# Altium schematic sheet RA8D2 MCU - Ports.SchDoc
size A3; Company Name: Renesas Electronics America; CompanyURL: www.renesas.com; PageSetup: Record=PageOptions|CenterHorizontal=True|CenterVertical=True|PrintScale=1.00|XCorrection=1.00|YCorrection=1.00|PrintKind=1|BorderSize=5000000|LeftOffset=0|BottomOffset=0|Orientation=2|PaperLength=1000|PaperWidth=1000|Scale=100|PaperSource=7|PrintQuality=-4|MediaType=1|DitherType=10|PaperKind=A5 148x210mm|PrintScaleMode=1; ReleaseDate: 16.09.2025; Version: MP; SheetNumber: 9; SheetTotal: 18; VariantNumber: 0; DSheetNumber: 1
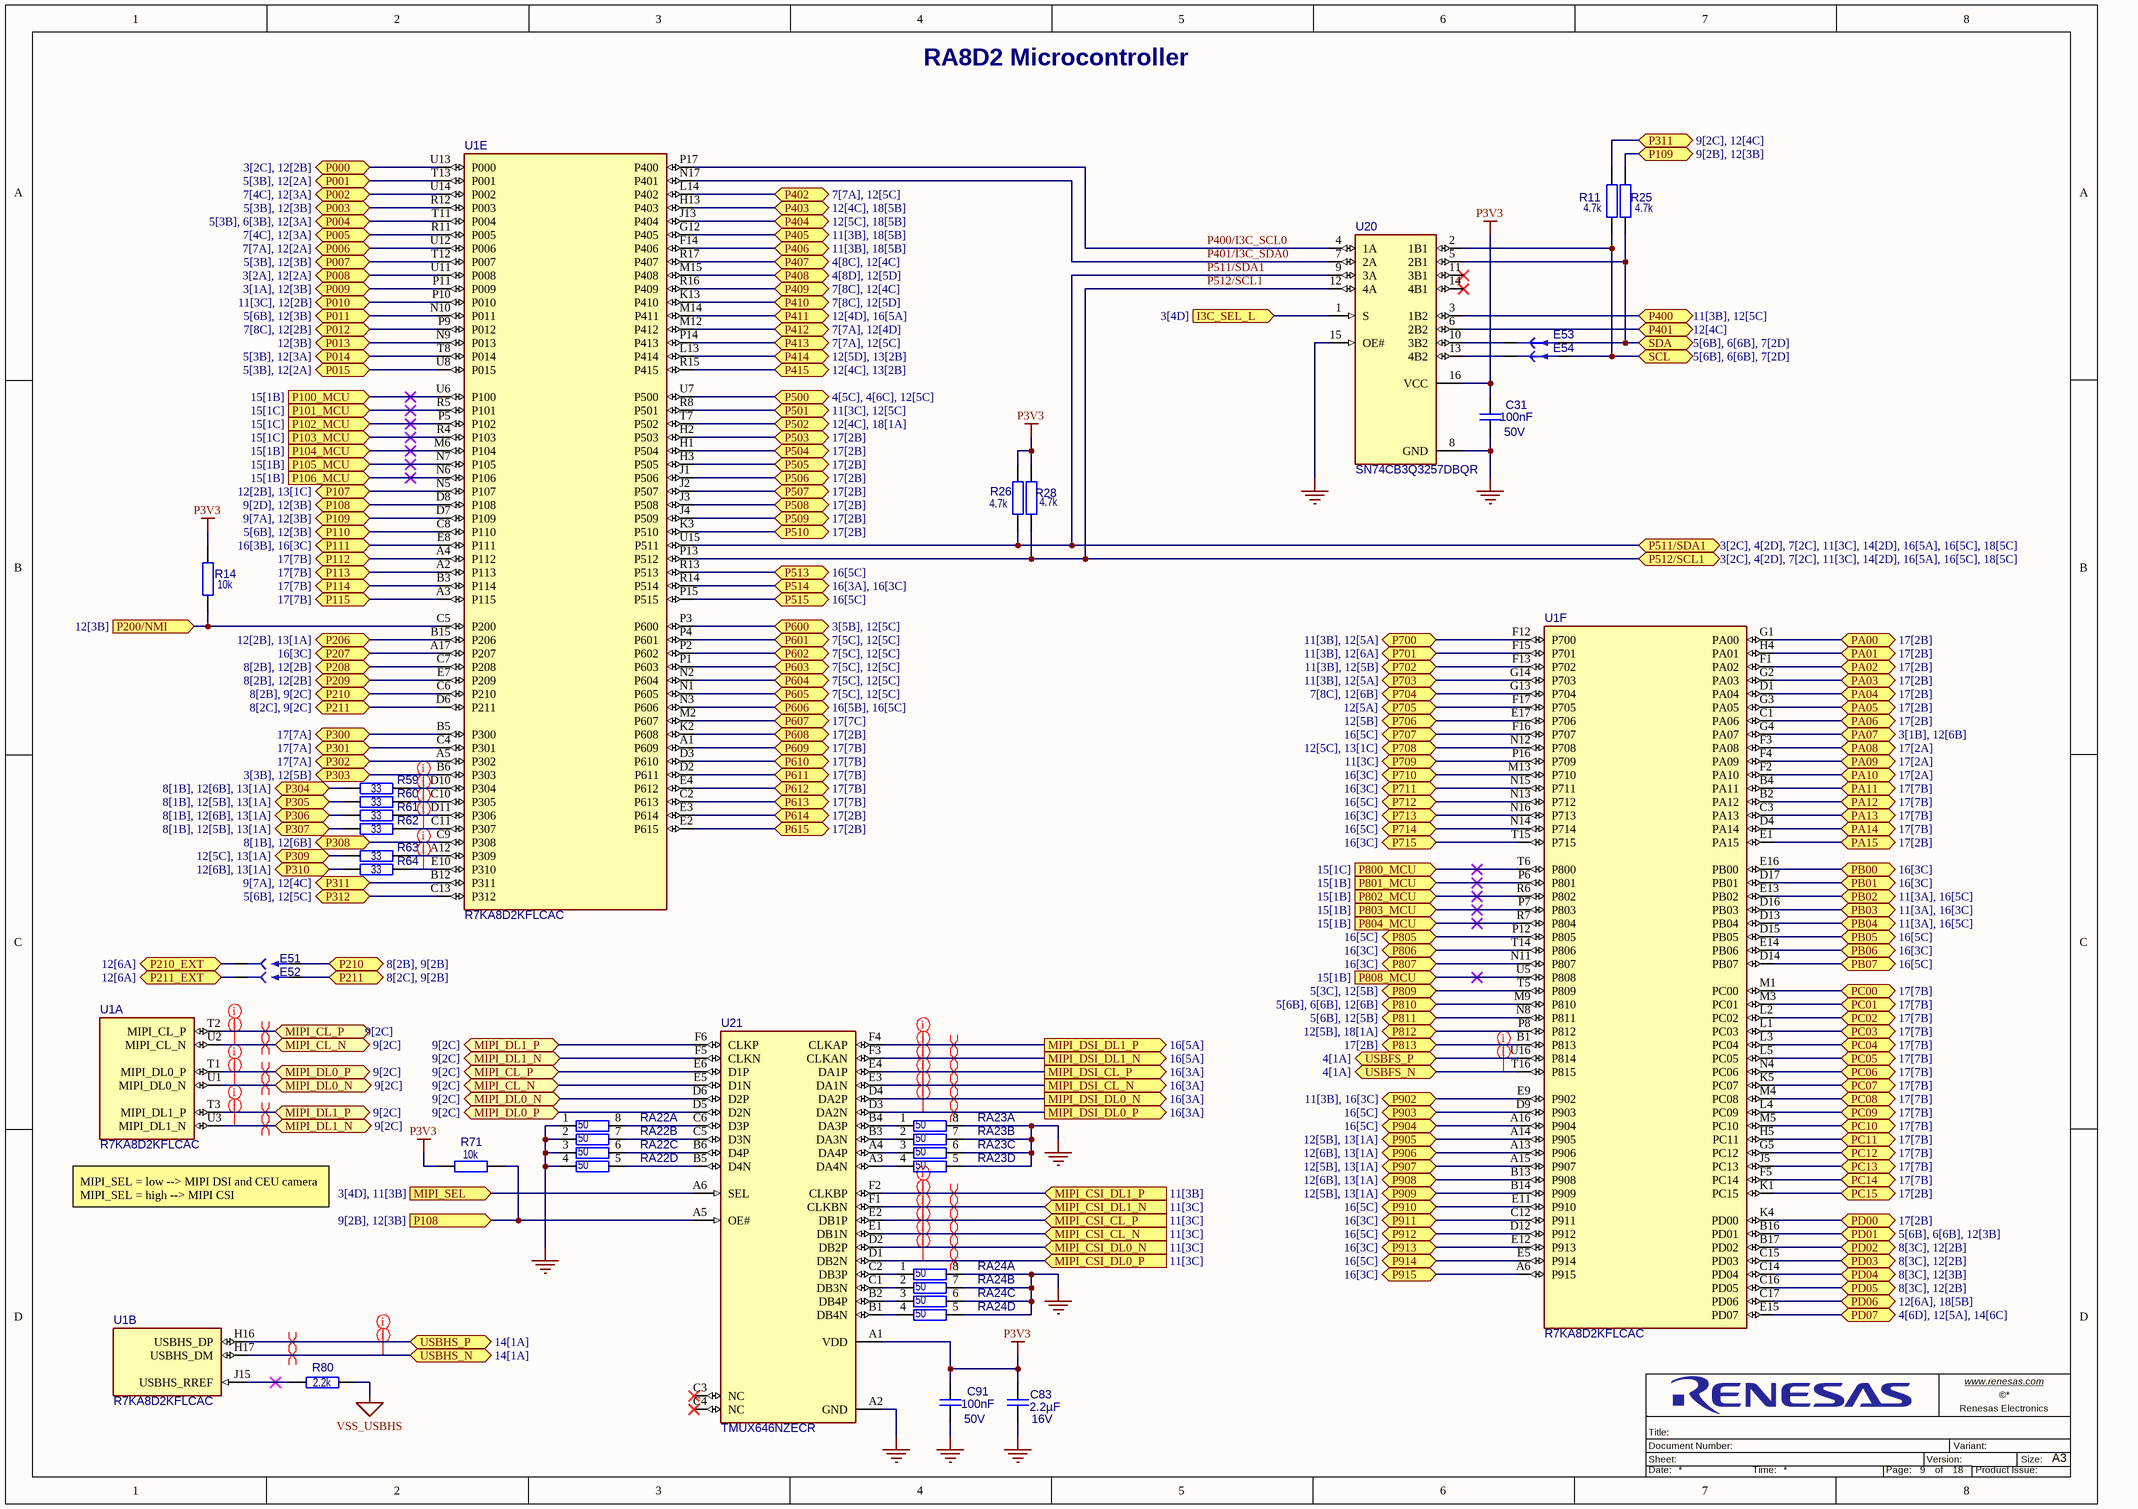
[diagram p0: RA8D2 MCU - Ports.SchDoc]

## Parts
C31  value 100nF  Operating Voltage Max: 50V  [C_EIA0402_0p55]  (hidden comment: Capacitor)
C83  value 2.2µF  Operating Voltage Max: 16V  [C_EIA0402_0p7]  (hidden comment: Capacitor)
C91  value 100nF  Operating Voltage Max: 50V  [C_EIA0402_0p55]  (hidden comment: Capacitor)
E51  SOLDER_BRIDGE_0805  [solder_bridge_0805]  (value not drawn)  (no BOM)
E52  SOLDER_BRIDGE_0805  [solder_bridge_0805]  (value not drawn)  (no BOM)
E53  TRACE_CUT_0805  [trace_cut_0805]  (value not drawn)  (net tie, no BOM)
E54  TRACE_CUT_0805  [trace_cut_0805]  (value not drawn)  (net tie, no BOM)
R11  value 4.7k  [R_EIA0402]  (hidden comment: Resistor)
R14  value 10k  [R_EIA0402]  (hidden comment: Resistor)
R25  value 4.7k  [R_EIA0402]  (hidden comment: Resistor)
R26  value 4.7k  [R_EIA0402]  (hidden comment: Resistor)
R28  value 4.7k  [R_EIA0402]  (hidden comment: Resistor)
R59  value 33  [R_EIA0402]  (hidden comment: Resistor)
R60  value 33  [R_EIA0402]  (hidden comment: Resistor)
R61  value 33  [R_EIA0402]  (hidden comment: Resistor)
R62  value 33  [R_EIA0402]  (hidden comment: Resistor)
R63  value 33  [R_EIA0402]  (hidden comment: Resistor)
R64  value 33  [R_EIA0402]  (hidden comment: Resistor)
R71  value 10k  [R_EIA0402]  (hidden comment: Resistor)
R80  value 2.2k  [R_EIA0402]  (hidden comment: Resistor)
RA22  value 50  [R_Array_EIA0804]  (hidden comment: YC124-FR-0749R9L)  (parts A,B,C,D of 4)
RA23  value 50  [R_Array_EIA0804]  (hidden comment: YC124-FR-0749R9L)  (parts A,B,C,D of 4)
RA24  value 50  [R_Array_EIA0804]  (hidden comment: YC124-FR-0749R9L)  (parts A,B,C,D of 4)
U1  R7KA8D2KFLCAC  [ren_bga289_PRBG0289JA-A]  (parts A,B,E,F of 6)
U20  SN74CB3Q3257DBQR  [ti_SSOP-16_4.9x3.9mm]
U21  TMUX646NZECR  [ti_NFBGA-36_ZEC0036A]

## Ports
I3C_SEL_L (in, see 3[4D]), MIPI_CL_N (bidir, see 9[2C]), MIPI_CL_P (bidir, see 9[2C]), MIPI_CSI_CL_N (in, see 11[3C]), MIPI_CSI_CL_P (in, see 11[3C]), MIPI_CSI_DL0_N (in, see 11[3C]), MIPI_CSI_DL0_P (in, see 11[3C]), MIPI_CSI_DL1_N (in, see 11[3C]), MIPI_CSI_DL1_P (in, see 11[3B]), MIPI_DL0_N (bidir, see 9[2C]), MIPI_DL0_P (bidir, see 9[2C]), MIPI_DL1_N (bidir, see 9[2C]), MIPI_DL1_P (bidir, see 9[2C]), MIPI_DSI_CL_N (out, see 16[3A]), MIPI_DSI_CL_P (out, see 16[3A]), MIPI_DSI_DL0_N (out, see 16[3A]), MIPI_DSI_DL0_P (out, see 16[3A]), MIPI_DSI_DL1_N (out, see 16[5A]), MIPI_DSI_DL1_P (out, see 16[5A]), MIPI_SEL (in, see 3[4D], 11[3B]), P000 (bidir, see 3[2C], 12[2B]), P001 (bidir, see 5[3B], 12[2A]), P002 (bidir, see 7[4C], 12[3A]), P003 (bidir, see 5[3B], 12[3B]), P004 (bidir, see 5[3B], 6[3B], 12[3A]), P005 (bidir, see 7[4C], 12[3A]), P006 (bidir, see 7[7A], 12[2A]), P007 (bidir, see 5[3B], 12[3B]), P008 (bidir, see 3[2A], 12[2A]), P009 (bidir, see 3[1A], 12[3B]), P010 (bidir, see 11[3C], 12[2B]), P011 (bidir, see 5[6B], 12[3B]), P012 (bidir, see 7[8C], 12[2B]), P013 (bidir, see 12[3B]), P014 (bidir, see 5[3B], 12[3A]), P015 (bidir, see 5[3B], 12[2A]), P100_MCU (in, see 15[1B]), P101_MCU (in, see 15[1C]), P102_MCU (in, see 15[1C]), P103_MCU (in, see 15[1C]), P104_MCU (in, see 15[1B]), P105_MCU (in, see 15[1B]), P106_MCU (in, see 15[1B]), P107 (bidir, see 12[2B], 13[1C]), P108 (bidir, see 9[2D], 12[3B]), P108 (in, see 9[2B], 12[3B]), P109 (bidir, see 9[2B], 12[3B]), P109 (bidir, see 9[7A], 12[3B]), P110 (bidir, see 5[6B], 12[3B]), P111 (bidir, see 16[3B], 16[3C]), P112 (bidir, see 17[7B]), P113 (bidir, see 17[7B]), P114 (bidir, see 17[7B]), P115 (bidir, see 17[7B]), P200/NMI (in, see 12[3B]), P206 (bidir, see 12[2B], 13[1A]), P207 (bidir, see 16[3C]), P208 (bidir, see 8[2B], 12[2B]), P209 (bidir, see 8[2B], 12[2B]), P210 (bidir, see 8[2B], 9[2B]), P210 (bidir, see 8[2B], 9[2C]), P210_EXT (bidir, see 12[6A]), P211 (bidir, see 8[2C], 9[2B]), P211 (bidir, see 8[2C], 9[2C]), P211_EXT (bidir, see 12[6A]), P300 (bidir, see 17[7A]), P301 (bidir, see 17[7A]), P302 (bidir, see 17[7A]), P303 (bidir, see 3[3B], 12[5B]), P304 (bidir, see 8[1B], 12[6B], 13[1A]), P305 (bidir, see 8[1B], 12[5B], 13[1A]), P306 (bidir, see 8[1B], 12[6B], 13[1A]), P307 (bidir, see 8[1B], 12[5B], 13[1A]), P308 (bidir, see 8[1B], 12[6B]), P309 (bidir, see 12[5C], 13[1A]), P310 (bidir, see 12[6B], 13[1A]), P311 (bidir, see 9[2C], 12[4C]), P311 (bidir, see 9[7A], 12[4C]), P312 (bidir, see 5[6B], 12[5C]), P400 (bidir, see 11[3B], 12[5C]), P401 (bidir, see 12[4C]), P402 (bidir, see 7[7A], 12[5C]), P403 (bidir, see 12[4C], 18[5B]), P404 (bidir, see 12[5C], 18[5B]), P405 (bidir, see 11[3B], 18[5B]), P406 (bidir, see 11[3B], 18[5B]), P407 (bidir, see 4[8C], 12[4C]), P408 (bidir, see 4[8D], 12[5D]), P409 (bidir, see 7[8C], 12[4C]), P410 (bidir, see 7[8C], 12[5D]), P411 (bidir, see 12[4D], 16[5A]), P412 (bidir, see 7[7A], 12[4D]), P413 (bidir, see 7[7A], 12[5C]), P414 (bidir, see 12[5D], 13[2B]), P415 (bidir, see 12[4C], 13[2B]), P500 (bidir, see 4[5C], 4[6C], 12[5C]), P501 (bidir, see 11[3C], 12[5C]), P502 (bidir, see 12[4C], 18[1A]), P503 (bidir, see 17[2B]), P504 (bidir, see 17[2B]), P505 (bidir, see 17[2B]), P506 (bidir, see 17[2B]), P507 (bidir, see 17[2B]), P508 (bidir, see 17[2B]), P509 (bidir, see 17[2B]), P510 (bidir, see 17[2B]), P511/SDA1 (bidir, see 3[2C], 4[2D], 7[2C], 11[3C], 14[2D], 16[5A], 16[5C], 18[5C]), P512/SCL1 (bidir, see 3[2C], 4[2D], 7[2C], 11[3C], 14[2D], 16[5A], 16[5C], 18[5C]), P513 (bidir, see 16[5C]), P514 (bidir, see 16[3A], 16[3C]), P515 (bidir, see 16[5C]), P600 (bidir, see 3[5B], 12[5C]), P601 (bidir, see 7[5C], 12[5C]), P602 (bidir, see 7[5C], 12[5C]), P603 (bidir, see 7[5C], 12[5C]), P604 (bidir, see 7[5C], 12[5C]), P605 (bidir, see 7[5C], 12[5C]), P606 (bidir, see 16[5B], 16[5C]), P607 (bidir, see 17[7C]), P608 (bidir, see 17[2B]), P609 (bidir, see 17[7B]), P610 (bidir, see 17[7B]), P611 (bidir, see 17[7B]), P612 (bidir, see 17[7B]), P613 (bidir, see 17[7B]), P614 (bidir, see 17[2B]), P615 (bidir, see 17[2B]), P700 (bidir, see 11[3B], 12[5A]), P701 (bidir, see 11[3B], 12[6A]), P702 (bidir, see 11[3B], 12[5B]), P703 (bidir, see 11[3B], 12[5A]), P704 (bidir, see 7[8C], 12[6B]), P705 (bidir, see 12[5A]), P706 (bidir, see 12[5B]), P707 (bidir, see 16[5C]), P708 (bidir, see 12[5C], 13[1C]), P709 (bidir, see 11[3C]), P710 (bidir, see 16[3C]), P711 (bidir, see 16[3C]), P712 (bidir, see 16[5C]), P713 (bidir, see 16[3C]), P714 (bidir, see 16[5C]), P715 (bidir, see 16[3C]), P800_MCU (in, see 15[1C]), P801_MCU (in, see 15[1B]), P802_MCU (in, see 15[1B]), P803_MCU (in, see 15[1B]), P804_MCU (in, see 15[1B]), P805 (bidir, see 16[5C]), P806 (bidir, see 16[3C]), P807 (bidir, see 16[3C]), P808_MCU (in, see 15[1B]), P809 (bidir, see 5[3C], 12[5B]), P810 (bidir, see 5[6B], 6[6B], 12[6B]), P811 (bidir, see 5[6B], 12[5B]), P812 (bidir, see 12[5B], 18[1A]), P813 (bidir, see 17[2B]), P902 (bidir, see 11[3B], 16[3C]), P903 (bidir, see 16[5C]), P904 (bidir, see 16[5C]), P905 (bidir, see 12[5B], 13[1A]), P906 (bidir, see 12[6B], 13[1A]), P907 (bidir, see 12[5B], 13[1A]), P908 (bidir, see 12[6B], 13[1A]), P909 (bidir, see 12[5B], 13[1A]), P910 (bidir, see 16[5C]), P911 (bidir, see 16[3C]), P912 (bidir, see 16[5C]), P913 (bidir, see 16[3C]), P914 (bidir, see 16[5C]), P915 (bidir, see 16[3C]), PA00 (bidir, see 17[2B]), PA01 (bidir, see 17[2B]), PA02 (bidir, see 17[2B]), PA03 (bidir, see 17[2B]), PA04 (bidir, see 17[2B]), PA05 (bidir, see 17[2B]), PA06 (bidir, see 17[2B]), PA07 (bidir, see 3[1B], 12[6B]), PA08 (bidir, see 17[2A]), PA09 (bidir, see 17[2A]), PA10 (bidir, see 17[2A]), PA11 (bidir, see 17[7B]), PA12 (bidir, see 17[7B]), PA13 (bidir, see 17[7B]), PA14 (bidir, see 17[7B]), PA15 (bidir, see 17[2B]), PB00 (bidir, see 16[3C]), PB01 (bidir, see 16[3C]), PB02 (bidir, see 11[3A], 16[5C]), PB03 (bidir, see 11[3A], 16[3C]), PB04 (bidir, see 11[3A], 16[5C]), PB05 (bidir, see 16[5C]), PB06 (bidir, see 16[3C]), PB07 (bidir, see 16[5C]), PC00 (bidir, see 17[7B]), PC01 (bidir, see 17[7B]), PC02 (bidir, see 17[7B]), PC03 (bidir, see 17[7B]), PC04 (bidir, see 17[7B]), PC05 (bidir, see 17[7B]), PC06 (bidir, see 17[7B]), PC07 (bidir, see 17[7B]), PC08 (bidir, see 17[7B]), PC09 (bidir, see 17[7B]), PC10 (bidir, see 17[7B]), PC11 (bidir, see 17[7B]), PC12 (bidir, see 17[7B]), PC13 (bidir, see 17[7B]), PC14 (bidir, see 17[7B]), PC15 (bidir, see 17[2B]), PD00 (bidir, see 17[2B]), PD01 (bidir, see 5[6B], 6[6B], 12[3B]), PD02 (bidir, see 8[3C], 12[2B]), PD03 (bidir, see 8[3C], 12[2B]), PD04 (bidir, see 8[3C], 12[3B]), PD05 (bidir, see 8[3C], 12[2B]), PD06 (bidir, see 12[6A], 18[5B]), PD07 (bidir, see 4[6D], 12[5A], 14[6C]), SCL (bidir, see 5[6B], 6[6B], 7[2D]), SDA (bidir, see 5[6B], 6[6B], 7[2D]), USBFS_N (bidir, see 4[1A]), USBFS_P (bidir, see 4[1A]), USBHS_N (bidir, see 14[1A]), USBHS_P (bidir, see 14[1A])

## Nets
GND: C31.1 C83.1 C91.1 RA22.1 RA22.2 RA22.3 RA22.4 RA23.5 RA23.6 RA23.7 RA23.8 RA24.5 RA24.6 RA24.7 RA24.8 U20.8(GND) U20.15(OE#) U21.A2(GND)
P3V3: C31.2 C83.2 C91.2 R14.2 R26.2 R28.2 R71.1 U20.16(VCC) U21.A1(VDD)
VSS_USBHS: R80.1
I3C_SEL_L: U20.1(S) ; port I3C_SEL_L
MIPI_CL_N: U1.U2(MIPI_CL_N) U21.E5(D1N) ; port MIPI_CL_N
MIPI_CL_P: U1.T2(MIPI_CL_P) U21.E6(D1P) ; port MIPI_CL_P
MIPI_CSI_CL_N: U21.E1(DB1N) ; port MIPI_CSI_CL_N
MIPI_CSI_CL_P: U21.E2(DB1P) ; port MIPI_CSI_CL_P
MIPI_CSI_DL0_N: U21.D2(DB2P) ; port MIPI_CSI_DL0_N
MIPI_CSI_DL0_P: U21.D1(DB2N) ; port MIPI_CSI_DL0_P
MIPI_CSI_DL1_N: U21.F1(CLKBN) ; port MIPI_CSI_DL1_N
MIPI_CSI_DL1_P: U21.F2(CLKBP) ; port MIPI_CSI_DL1_P
MIPI_DL0_N: U1.U1(MIPI_DL0_N) U21.D6(D2P) ; port MIPI_DL0_N
MIPI_DL0_P: U1.T1(MIPI_DL0_P) U21.D5(D2N) ; port MIPI_DL0_P
MIPI_DL1_N: U1.U3(MIPI_DL1_N) U21.F5(CLKN) ; port MIPI_DL1_N
MIPI_DL1_P: U1.T3(MIPI_DL1_P) U21.F6(CLKP) ; port MIPI_DL1_P
MIPI_DSI_CL_N: U21.E3(DA1N) ; port MIPI_DSI_CL_N
MIPI_DSI_CL_P: U21.E4(DA1P) ; port MIPI_DSI_CL_P
MIPI_DSI_DL0_N: U21.D4(DA2P) ; port MIPI_DSI_DL0_N
MIPI_DSI_DL0_P: U21.D3(DA2N) ; port MIPI_DSI_DL0_P
MIPI_DSI_DL1_N: U21.F3(CLKAN) ; port MIPI_DSI_DL1_N
MIPI_DSI_DL1_P: U21.F4(CLKAP) ; port MIPI_DSI_DL1_P
MIPI_SEL: U21.A6(SEL) ; port MIPI_SEL
P000: U1.U13(P000) ; port P000
P001: U1.T13(P001) ; port P001
P002: U1.U14(P002) ; port P002
P003: U1.R12(P003) ; port P003
P004: U1.T11(P004) ; port P004
P005: U1.R11(P005) ; port P005
P006: U1.U12(P006) ; port P006
P007: U1.T12(P007) ; port P007
P008: U1.U11(P008) ; port P008
P009: U1.P11(P009) ; port P009
P010: U1.P10(P010) ; port P010
P011: U1.N10(P011) ; port P011
P012: U1.P9(P012) ; port P012
P013: U1.N9(P013) ; port P013
P014: U1.T8(P014) ; port P014
P015: U1.U8(P015) ; port P015
P100_MCU: U1.U6(P100) ; port P100_MCU
P101_MCU: U1.R5(P101) ; port P101_MCU
P102_MCU: U1.P5(P102) ; port P102_MCU
P103_MCU: U1.R4(P103) ; port P103_MCU
P104_MCU: U1.M6(P104) ; port P104_MCU
P105_MCU: U1.N7(P105) ; port P105_MCU
P106_MCU: U1.N6(P106) ; port P106_MCU
P107: U1.N5(P107) ; port P107
P108: R71.2 U1.D8(P108) U21.A5(OE#) ; port P108
P109: R25.2 U1.D7(P109) ; port P109
P110: U1.C8(P110) ; port P110
P111: U1.E8(P111) ; port P111
P112: U1.A4(P112) ; port P112
P113: U1.A2(P113) ; port P113
P114: U1.B3(P114) ; port P114
P115: U1.A3(P115) ; port P115
P200/NMI: R14.1 U1.C5(P200) ; port P200/NMI
P206: U1.B15(P206) ; port P206
P207: U1.A17(P207) ; port P207
P208: U1.C7(P208) ; port P208
P209: U1.E7(P209) ; port P209
P210: E51.2 U1.C6(P210) ; port P210
P210_EXT: E51.1 ; port P210_EXT
P211: E52.2 U1.D6(P211) ; port P211
P211_EXT: E52.1 ; port P211_EXT
P300: U1.B5(P300) ; port P300
P301: U1.C4(P301) ; port P301
P302: U1.A5(P302) ; port P302
P303: U1.B6(P303) ; port P303
P304: R59.1 ; port P304
P305: R60.1 ; port P305
P306: R61.1 ; port P306
P307: R62.1 ; port P307
P308: U1.C9(P308) ; port P308
P309: R63.1 ; port P309
P310: R64.1 ; port P310
P311: R11.2 U1.B12(P311) ; port P311
P312: U1.C13(P312) ; port P312
P400: U20.3(1B2) ; port P400
P400/I3C_SCL0: U1.P17(P400) U20.4(1A)
P401: U20.6(2B2) ; port P401
P401/I3C_SDA0: U1.N17(P401) U20.7(2A)
P402: U1.L14(P402) ; port P402
P403: U1.H13(P403) ; port P403
P404: U1.J13(P404) ; port P404
P405: U1.G12(P405) ; port P405
P406: U1.F14(P406) ; port P406
P407: U1.R17(P407) ; port P407
P408: U1.M15(P408) ; port P408
P409: U1.R16(P409) ; port P409
P410: U1.K13(P410) ; port P410
P411: U1.M14(P411) ; port P411
P412: U1.M12(P412) ; port P412
P413: U1.P14(P413) ; port P413
P414: U1.L13(P414) ; port P414
P415: U1.R15(P415) ; port P415
P500: U1.U7(P500) ; port P500
P501: U1.R8(P501) ; port P501
P502: U1.T7(P502) ; port P502
P503: U1.H2(P503) ; port P503
P504: U1.H1(P504) ; port P504
P505: U1.H3(P505) ; port P505
P506: U1.J1(P506) ; port P506
P507: U1.J2(P507) ; port P507
P508: U1.J3(P508) ; port P508
P509: U1.J4(P509) ; port P509
P510: U1.K3(P510) ; port P510
P511/SDA1: R26.1 U1.U15(P511) U20.9(3A) ; port P511/SDA1
P512/SCL1: R28.1 U1.P13(P512) U20.12(4A) ; port P512/SCL1
P513: U1.R13(P513) ; port P513
P514: U1.R14(P514) ; port P514
P515: U1.P15(P515) ; port P515
P600: U1.P3(P600) ; port P600
P601: U1.P4(P601) ; port P601
P602: U1.P2(P602) ; port P602
P603: U1.P1(P603) ; port P603
P604: U1.N2(P604) ; port P604
P605: U1.N1(P605) ; port P605
P606: U1.N3(P606) ; port P606
P607: U1.M2(P607) ; port P607
P608: U1.K2(P608) ; port P608
P609: U1.A1(P609) ; port P609
P610: U1.D3(P610) ; port P610
P611: U1.D2(P611) ; port P611
P612: U1.E4(P612) ; port P612
P613: U1.C2(P613) ; port P613
P614: U1.E3(P614) ; port P614
P615: U1.E2(P615) ; port P615
P700: U1.F12(P700) ; port P700
P701: U1.F15(P701) ; port P701
P702: U1.F13(P702) ; port P702
P703: U1.G14(P703) ; port P703
P704: U1.G13(P704) ; port P704
P705: U1.F17(P705) ; port P705
P706: U1.E17(P706) ; port P706
P707: U1.F16(P707) ; port P707
P708: U1.N12(P708) ; port P708
P709: U1.P16(P709) ; port P709
P710: U1.M13(P710) ; port P710
P711: U1.N15(P711) ; port P711
P712: U1.N13(P712) ; port P712
P713: U1.N16(P713) ; port P713
P714: U1.N14(P714) ; port P714
P715: U1.T15(P715) ; port P715
P800_MCU: U1.T6(P800) ; port P800_MCU
P801_MCU: U1.P6(P801) ; port P801_MCU
P802_MCU: U1.R6(P802) ; port P802_MCU
P803_MCU: U1.P7(P803) ; port P803_MCU
P804_MCU: U1.R7(P804) ; port P804_MCU
P805: U1.P12(P805) ; port P805
P806: U1.T14(P806) ; port P806
P807: U1.N11(P807) ; port P807
P808_MCU: U1.U5(P808) ; port P808_MCU
P809: U1.T5(P809) ; port P809
P810: U1.M9(P810) ; port P810
P811: U1.N8(P811) ; port P811
P812: U1.P8(P812) ; port P812
P813: U1.B1(P813) ; port P813
P902: U1.E9(P902) ; port P902
P903: U1.D9(P903) ; port P903
P904: U1.A16(P904) ; port P904
P905: U1.A14(P905) ; port P905
P906: U1.A13(P906) ; port P906
P907: U1.A15(P907) ; port P907
P908: U1.B13(P908) ; port P908
P909: U1.B14(P909) ; port P909
P910: U1.E11(P910) ; port P910
P911: U1.C12(P911) ; port P911
P912: U1.D12(P912) ; port P912
P913: U1.E12(P913) ; port P913
P914: U1.E5(P914) ; port P914
P915: U1.A6(P915) ; port P915
PA00: U1.G1(PA00) ; port PA00
PA01: U1.H4(PA01) ; port PA01
PA02: U1.F1(PA02) ; port PA02
PA03: U1.G2(PA03) ; port PA03
PA04: U1.D1(PA04) ; port PA04
PA05: U1.G3(PA05) ; port PA05
PA06: U1.C1(PA06) ; port PA06
PA07: U1.G4(PA07) ; port PA07
PA08: U1.F3(PA08) ; port PA08
PA09: U1.F4(PA09) ; port PA09
PA10: U1.F2(PA10) ; port PA10
PA11: U1.B4(PA11) ; port PA11
PA12: U1.B2(PA12) ; port PA12
PA13: U1.C3(PA13) ; port PA13
PA14: U1.D4(PA14) ; port PA14
PA15: U1.E1(PA15) ; port PA15
PB00: U1.E16(PB00) ; port PB00
PB01: U1.D17(PB01) ; port PB01
PB02: U1.E13(PB02) ; port PB02
PB03: U1.D16(PB03) ; port PB03
PB04: U1.D13(PB04) ; port PB04
PB05: U1.D15(PB05) ; port PB05
PB06: U1.E14(PB06) ; port PB06
PB07: U1.D14(PB07) ; port PB07
PC00: U1.M1(PC00) ; port PC00
PC01: U1.M3(PC01) ; port PC01
PC02: U1.L2(PC02) ; port PC02
PC03: U1.L1(PC03) ; port PC03
PC04: U1.L3(PC04) ; port PC04
PC05: U1.L5(PC05) ; port PC05
PC06: U1.N4(PC06) ; port PC06
PC07: U1.K5(PC07) ; port PC07
PC08: U1.M4(PC08) ; port PC08
PC09: U1.L4(PC09) ; port PC09
PC10: U1.M5(PC10) ; port PC10
PC11: U1.H5(PC11) ; port PC11
PC12: U1.G5(PC12) ; port PC12
PC13: U1.J5(PC13) ; port PC13
PC14: U1.F5(PC14) ; port PC14
PC15: U1.K1(PC15) ; port PC15
PD00: U1.K4(PD00) ; port PD00
PD01: U1.B16(PD01) ; port PD01
PD02: U1.B17(PD02) ; port PD02
PD03: U1.C15(PD03) ; port PD03
PD04: U1.C14(PD04) ; port PD04
PD05: U1.C16(PD05) ; port PD05
PD06: U1.C17(PD06) ; port PD06
PD07: U1.E15(PD07) ; port PD07
SCL: E54.2 R11.1 U20.2(1B1) ; port SCL
SDA: E53.2 R25.1 U20.5(2B1) ; port SDA
USBFS_N: U1.T16(P815) ; port USBFS_N
USBFS_P: U1.U16(P814) ; port USBFS_P
USBHS_N: U1.H17(USBHS_DM) ; port USBHS_N
USBHS_P: U1.H16(USBHS_DP) ; port USBHS_P
NetE53_1: E53.1 U20.10(3B2)
NetE54_1: E54.1 U20.13(4B2)
NetR59_2: R59.2 U1.D10(P304)
NetR60_2: R60.2 U1.C10(P305)
NetR61_2: R61.2 U1.D11(P306)
NetR62_2: R62.2 U1.C11(P307)
NetR63_2: R63.2 U1.A12(P309)
NetR64_2: R64.2 U1.E10(P310)
NetR80_2: R80.2 U1.J15(USBHS_RREF)
NetRA22_5: RA22.5 U21.B5(D4N)
NetRA22_6: RA22.6 U21.B6(D4P)
NetRA22_7: RA22.7 U21.C5(D3N)
NetRA22_8: RA22.8 U21.C6(D3P)
NetRA23_1: RA23.1 U21.B4(DA3P)
NetRA23_2: RA23.2 U21.B3(DA3N)
NetRA23_3: RA23.3 U21.A4(DA4P)
NetRA23_4: RA23.4 U21.A3(DA4N)
NetRA24_1: RA24.1 U21.C2(DB3P)
NetRA24_2: RA24.2 U21.C1(DB3N)
NetRA24_3: RA24.3 U21.B2(DB4P)
NetRA24_4: RA24.4 U21.B1(DB4N)

Not connected (* = marked no-connect by the designer): U20 11(3B1)* 14(4B1)*; U21 C3(NC)* C4(NC)*

## Layout directives
differential pair; differential pair class USB: USBHS_N, USBHS_P
differential pair; differential pair class MIPI: MIPI_CL_N, MIPI_CL_P, MIPI_DL0_N, MIPI_DL0_P, MIPI_DL1_N, MIPI_DL1_P
net class MIPI_DIFF_CL: MIPI_CL_N, MIPI_CL_P
net class MIPI_DIFF_DL0: MIPI_DL0_N, MIPI_DL0_P
net class MIPI_DIFF_DL1: MIPI_DL1_N, MIPI_DL1_P
net class USBHS: USBHS_N, USBHS_P
net class USBFS: USBFS_N, USBFS_P
differential pair; differential pair class MIPI_DSI: MIPI_DSI_CL_N, MIPI_DSI_CL_P, MIPI_DSI_DL0_N, MIPI_DSI_DL0_P, MIPI_DSI_DL1_N, MIPI_DSI_DL1_P
net class MIPI_DIFF_DSI: MIPI_DSI_CL_N, MIPI_DSI_CL_P, MIPI_DSI_DL0_N, MIPI_DSI_DL0_P, MIPI_DSI_DL1_N, MIPI_DSI_DL1_P
differential pair; differential pair class MIPI_CSI: MIPI_CSI_CL_N, MIPI_CSI_CL_P, MIPI_CSI_DL0_N, MIPI_CSI_DL0_P, MIPI_CSI_DL1_N, MIPI_CSI_DL1_P
net class MIPI_DIFF_CSI: MIPI_CSI_CL_N, MIPI_CSI_CL_P, MIPI_CSI_DL0_N, MIPI_CSI_DL0_P, MIPI_CSI_DL1_N, MIPI_CSI_DL1_P
rule Length Constraint [Min Length = 0mm    Max Length = 15mm]: NetR59_2, NetR60_2, NetR61_2, NetR62_2, NetR63_2, NetR64_2

## Notes on the sheet
- RA8D2 Microcontroller
- (near U1) MIPI_SEL = low --> MIPI DSI and CEU camera
  MIPI_SEL = high --> MIPI CSI
- www.renesas.com <http://www.renesas.com>
- Sheet:
- Title:
- Document Number:
- Version:
- Variant:
- Renesas Electronics
- Size:
- A3
- Date:
- Time:
- Page:
- of
- Product Issue:

## Library data of the parts
C31 C91 = CAP-00003203-9: Capacitor,EIA0402,100n,50V,X7R; Tolerance: 10%; Qualification: AEC-Q200; Subtype: MLCC; Dielectric: X7R; Height: 550µm; Operating Temperature Max: 125°C; Operating Temperature Min: -55°C
C83 = CAP-00000015-4: Capacitor,EIA0402,2.2u,16V,X6S; Tolerance: 10%; Qualification: AEC-Q200; Subtype: MLCC; Dielectric: X6S; Height: 700µm; Operating Temperature Max: 105°C; Operating Temperature Min: -55°C
E51 E52 = MIS-00000002-7: Solder Bridge, SMD, 0805 size; Value: SB; Subtype: Solder Bridge; Qualification: -; Pin Count: 2
E53 E54 = MIS-00000000-11: Trace Cut, SMD, 0805 size; Value: TC; Pin Count: 2; Qualification: -; Subtype: Trace Cut
R11 R25 R26 R28 = RES-00000894-9: Resistor,EIA0402,4.7k,0.0625W; Power: 62.5mW; Tolerance: 1%; Subtype: Chip Resistor; Operating Temperature Max: 155°C; Operating Temperature Min: -55°C; Qualification: -
R14 R71 = RES-00000902-9: Resistor,EIA0402,10k,0.0625W; Power: 62.5mW; Tolerance: 1%; Subtype: Chip Resistor; Operating Temperature Max: 155°C; Operating Temperature Min: -55°C; Qualification: -
R59-R64 = RES-00000842-9: Resistor,EIA0402,33,0.0625W; Power: 62.5mW; Tolerance: 1%; Subtype: Chip Resistor; Operating Temperature Max: 155°C; Operating Temperature Min: -55°C; Qualification: -
R80 = RES-00000886-9: Resistor,EIA0402,2.2k,0.0625W; Power: 62.5mW; Tolerance: 1%; Subtype: Chip Resistor; Operating Temperature Max: 155°C; Operating Temperature Min: -55°C; Qualification: -
RA22-RA24 = RES-00003219-6: Resistor Network & Array,0804, 50,0.0625W; Subtype: Chip Resistor; Tolerance: 1%; Temperature Coefficient: 200ppm; Power: 62mW; Qualification: AEC-Q200; Operating Temperature Max: 155°C; Operating Temperature Min: -55°C; Height: 550µm
U1 = ICS-00000098-4: Renesas RA8D2 32-bit MCU, High-performance 1 GHz Arm® Cortex®-M85 core, 250 MHz Arm® Cortex®-M33 core, up to 1 MB code MRAM, and 2 MB SRAM with ECC; Subtype: MCU/MPU; Operating Voltage Min: 1.62V; Frequency: 1GHz; Operating Voltage Max: 3.63V; Qualification: -; Operating Temperature Max: 95°C; Pin Count: 289; Operating Temperature Min: 0°C
U20 = ICS-00000021-6: 4-Bit 1-of-2 FET Multiplexer/Demultiplexer 2.5-V/3.3-V Low-Voltage High-Bandwidth Bus Switch; Operating Voltage Min: 2.3V; Output Voltage Min: 0V; Output Voltage Max: 5.5V; Operating Voltage Max: 3.6V; Qualification: -; Operating Temperature Min: -40°C; Operating Temperature Max: 85°C; Pin Count: 16; Subtype: Bus Switch
U21 = ICS-00000096-4: 6-GHz, 5-V, 2: 1 (SPDT) 10-channel MIPI switch with 1.8-V logic support 36-NFBGA -40 to 85; Current: 35mA; Load Capacitance: 1.5pF; Frequency: 6GHz; Operating Voltage Max: 5.5V; Subtype: Bus Switch; Operating Voltage Min: 1.5V; Qualification: -; Operating Temperature Max: 85°C; Operating Temperature Min: -40°C; Pin Count: 36